# Altium schematic sheet Napajanje_1.SchDoc
size A4
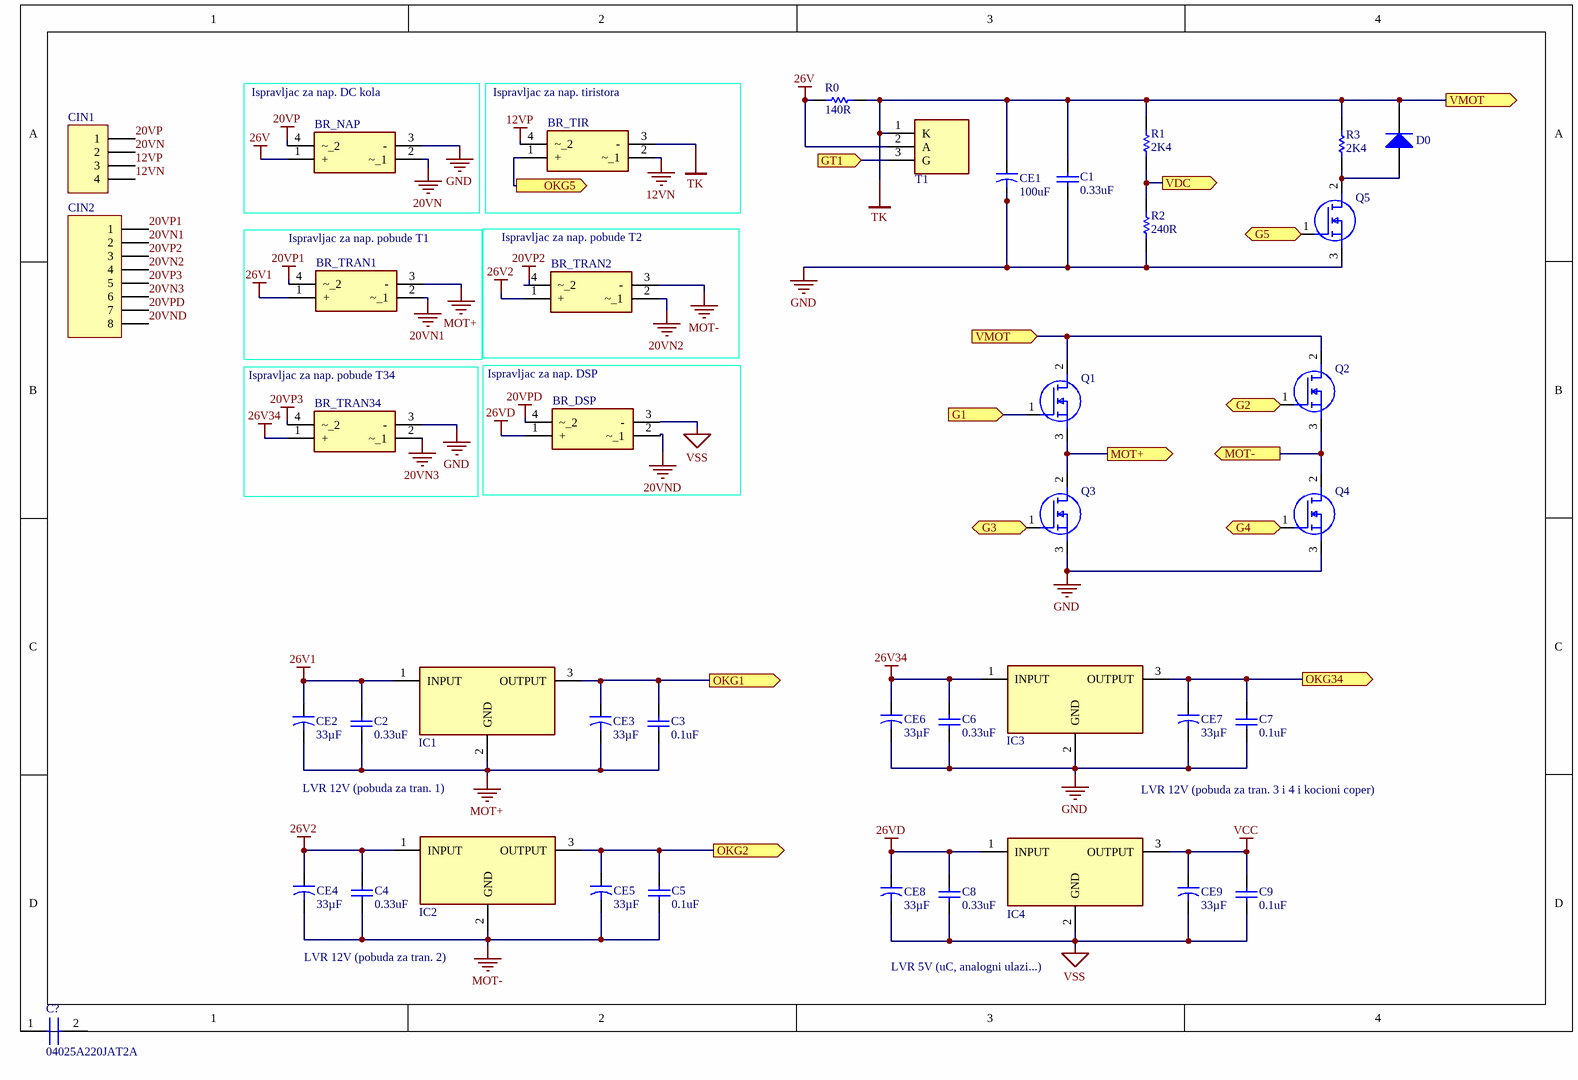
[diagram p0: Napajanje_1.SchDoc]

## Parts
BR_DSP  W04G-E4/51GI-ND  [BRIGE RECTIFIER]  (value not drawn)
BR_NAP  W04G-E4/51GI-ND  [BRIGE RECTIFIER]  (value not drawn)
BR_TIR  W04G-E4/51GI-ND  [BRIGE RECTIFIER]  (value not drawn)
BR_TRAN1  W04G-E4/51GI-ND  [BRIGE RECTIFIER]  (value not drawn)
BR_TRAN2  W04G-E4/51GI-ND  [BRIGE RECTIFIER]  (value not drawn)
BR_TRAN34  W04G-E4/51GI-ND  [BRIGE RECTIFIER]  (value not drawn)
C1  value 0.33uF  [CAP3, 0.33uF, 50V]  (hidden comment: 1C20Z5U334M050B-ND)  (graphical)
C2  value 0.33uF  [CAP3, 0.33uF, 50V]  (hidden comment: 1C20Z5U334M050B-ND)  (graphical)
C3  value 0.1uF  [CAP4, 0.1uF, 50V]  (hidden comment: BC1160TR-ND)
C4  value 0.33uF  [CAP3, 0.33uF, 50V]  (hidden comment: 1C20Z5U334M050B-ND)  (graphical)
C5  value 0.1uF  [CAP4, 0.1uF, 50V]  (hidden comment: BC1160TR-ND)
C6  value 0.33uF  [CAP3, 0.33uF, 50V]  (hidden comment: 1C20Z5U334M050B-ND)  (graphical)
C7  value 0.1uF  [CAP4, 0.1uF, 50V]  (hidden comment: BC1160TR-ND)
C8  value 0.33uF  [CAP3, 0.33uF, 50V]  (hidden comment: 1C20Z5U334M050B-ND)  (graphical)
C9  value 0.1uF  [CAP4, 0.1uF, 50V]  (hidden comment: BC1160TR-ND)
C?  04025A220JAT2A  [CAPC1005X56N]
CE1  value 100uF  [CAP2 100uF, 35V]  (hidden comment: 399-6104-ND)
CE2  value 33µF  [CAP1 33uF, 35V]  (hidden comment: 399-6575-ND)
CE3  value 33µF  [CAP1 33uF, 35V]  (hidden comment: 399-6575-ND)
CE4  value 33µF  [CAP1 33uF, 35V]  (hidden comment: 399-6575-ND)
CE5  value 33µF  [CAP1 33uF, 35V]  (hidden comment: 399-6575-ND)
CE6  value 33µF  [CAP1 33uF, 35V]  (hidden comment: 399-6575-ND)
CE7  value 33µF  [CAP1 33uF, 35V]  (hidden comment: 399-6575-ND)
CE8  value 33µF  [CAP1 33uF, 35V]  (hidden comment: 399-6575-ND)
CE9  value 33µF  [CAP1 33uF, 35V]  (hidden comment: 399-6575-ND)
CIN1  Header  [HEADER 4 PIN]  (value not drawn)
CIN2  (no value)  [HEADER 8 PIN]
D0  UF4007TR-ND  [DIODE, 1000V, 1A]  (value not drawn)
IC1  512-LM7812ACT  [LM7812ACT, 1A]  (value not drawn)
IC2  512-LM7812ACT  [LM7812ACT, 1A]  (value not drawn)
IC3  512-LM7812ACT  [LM7812ACT, 1A]  (value not drawn)
IC4  LM7805ACT  [LM7805ACT, 1A]  (value not drawn)
Q1  STP7NK40ZFP  [MOSFET 400V, 5.4A]  (value not drawn)
Q2  STP7NK40ZFP  [MOSFET 400V, 5.4A]  (value not drawn)
Q3  STP7NK40ZFP  [MOSFET 400V, 5.4A]  (value not drawn)
Q4  STP7NK40ZFP  [MOSFET 400V, 5.4A]  (value not drawn)
Q5  STP7NK40ZFP  [MOSFET 400V, 5.4A]  (value not drawn)
R0  value 140R  [RES5, 140R, 0.25W - duplicate]  (hidden comment: 140XBK-ND)
R1  value 2K4  [RES2, 2K4, 0.25W - duplicate]  (hidden comment: 270QBK-ND)
R2  value 240R  [RES1, 240R, 0.25W]  (hidden comment: 270QBK-ND)
R3  value 2K4  [RES2, 2K4, 0.25W - duplicate]  (hidden comment: 270QBK-ND)
T1  Thyristor1  [THYRISTOR 400V, 8A]  (value not drawn)

## Sub-sheets
Ispravljac za nap. DC kola = ?: no entries
Ispravljac za nap. DSP = ?: no entries
Ispravljac za nap. pobude T1 = ?: no entries
Ispravljac za nap. pobude T2 = ?: no entries
Ispravljac za nap. pobude T34 = ?: no entries
Ispravljac za nap. tiristora = ?: no entries

## Ports
G1 (in), G2 (in), G3 (in), G4 (in), G5 (in), GT1 (in), MOT+ (out), MOT- (out), OKG1 (out), OKG2 (out), OKG5 (out), OKG34 (out), VDC (out), VMOT (in), VMOT (out)

## Nets
12VN: BR_TIR.2(~_1) CIN1.4
12VP: BR_TIR.4(~_2) CIN1.3
20VN: BR_NAP.2(~_1) CIN1.2
20VN1: BR_TRAN1.2(~_1) CIN2.2
20VN2: BR_TRAN2.2(~_1) CIN2.4
20VN3: BR_TRAN34.2(~_1) CIN2.6
20VND: BR_DSP.2(~_1) CIN2.8
20VP: BR_NAP.4(~_2) CIN1.1
20VP1: BR_TRAN1.4(~_2) CIN2.1
20VP2: BR_TRAN2.4(~_2) CIN2.3
20VP3: BR_TRAN34.4(~_2) CIN2.5
20VPD: BR_DSP.4(~_2) CIN2.7
26V: BR_NAP.1(+) R0.2 T1.2(A)
26V1: BR_TRAN1.1(+) C2.2 CE2.1 IC1.1(INPUT)
26V2: BR_TRAN2.1(+) C4.2 CE4.1 IC2.1(INPUT)
26V34: BR_TRAN34.1(+) C6.2 CE6.1 IC3.1(INPUT)
26VD: BR_DSP.1(+) C8.2 CE8.1 IC4.1(INPUT)
GND: BR_NAP.3(-) BR_TRAN34.3(-) C1.1 C6.1 C7.1 CE1.2 CE6.2 CE7.2 IC3.2(GND) Q3.3(S) Q4.3(S) Q5.3(S) R2.1
MOT+: BR_TRAN1.3(-) C2.1 C3.1 CE2.2 CE3.2 IC1.2(GND)
MOT-: BR_TRAN2.3(-) C4.1 C5.1 CE4.2 CE5.2 IC2.2(GND)
TK: BR_TIR.3(-) C1.2 CE1.1 D0.2(K) Q1.2(D) Q2.2(D) R0.1 R1.2 R3.2 T1.1(K) ; port VMOT
VCC: C9.2 CE9.1 IC4.3(OUTPUT)
VSS: BR_DSP.3(-) C8.1 C9.1 CE8.2 CE9.2 IC4.2(GND)
G1: Q1.1(G) ; port G1
G2: Q2.1(G) ; port G2
G3: Q3.1(G) ; port G3
G4: Q4.1(G) ; port G4
G5: Q5.1(G) ; port G5
GT1: T1.3(G) ; port GT1
MOT+: Q1.3(S) Q3.2(D) ; port MOT+  [a separate net that carries the same name]
MOT-: Q2.3(S) Q4.2(D) ; port MOT-  [a separate net that carries the same name]
OKG1: C3.2 CE3.1 IC1.3(OUTPUT) ; port OKG1
OKG2: C5.2 CE5.1 IC2.3(OUTPUT) ; port OKG2
OKG5: BR_TIR.1(+) ; port OKG5
OKG34: C7.2 CE7.1 IC3.3(OUTPUT) ; port OKG34
VDC: R1.1 R2.2 ; port VDC
NetD0_1: D0.1(A) Q5.2(D) R3.1

Not connected (* = marked no-connect by the designer): C? 1 2

## Notes on the sheet
- LVR 12V (pobuda za tran. 1)
- LVR 12V (pobuda za tran. 3 i 4 i kocioni coper)
- LVR 12V (pobuda za tran. 2)
- LVR 5V (uC, analogni ulazi...)

## Library data of the parts
BR_DSP BR_NAP BR_TIR BR_TRAN1 BR_TRAN2 BR_TRAN34 = Bridge rectifier: 1 Phase, 400V, 1.5A; Detailed Description: Bridge Rectifier Single Phase Standard 400V Through Hole WOG; Datasheet link: http://www.vishay.com/docs/88769/woo5g.pdf; Digi-Key Part Number: W04G-E4/51GI-ND; Manufacturer Part Number: W04G-E4/51
C1 C2 C4 C6 C8 = Cap3: CER 0.33uF, 50V; Manufacturer: Vishay BC Components; Digi-Key Part Number: 1C20Z5U334M050B-ND; Datasheet Link: https://media.digikey.com/pdf/Data%20Sheets/BC%20Components%20PDFs/1C-9C_Series_Rev_Sep_2015.pdf; Manufacturer Part Number: 1C20Z5U334M050B
C3 C5 C7 C9 = Cap4: CER 0.1uF, 50V; Manufacturer: Vishay BC Components; Manufacturer Part Number: K104Z15Y5VF5TL2; Detailed Description: 0.1µF -20%, +80% 50V Ceramic Capacitor Y5V (F) Radial; Digi-Key Part Number: BC1160TR-ND; Datasheet: http://www.vishay.com/docs/45171/kseries.pdf
C? = 04025A220JAT2A: Capacitor; Manufacturer_Name: AVX; Datasheet Link: http://www.mouser.com/catalog/supplier/library/pdf/AVXSurfaceMountCeramic.pdf; Height: 0.56mm; Manufacturer_Part_Number: 04025A220JAT2A; Arrow Part Number: 04025A220JAT2A; Arrow Price/Stock: https://www.arrow.com/en/products/04025a220jat2a/avx; Mouser Part Number: 581-04025A220J; Mouser Price/Stock: https://www.mouser.com/Search/Refine.aspx?Keyword=581-04025A220J
CE1 = Cap2: ALU 100uF, 35V; Manufacturer: KEMET; Manufacturer Part Number: ESK107M035AE3AA; Digi-Key Part Number: 399-6104-ND; Datasheet link: https://api.kemet.com/component-edge/download/specsheet/ESK107M035AE3AA.pdf
CE2-CE9 = Cap1: ALU 33uF, 35V; Manufacturer: KEMET; Manufacturer Part Number: ESH336M035AC3AA; Detailed Description: 33µF 35V Aluminum Electrolytic Capacitors Radial, Can  2000 Hrs @ 105°C; Digi-Key Part Number: 399-6575-ND; Datasheet: https://content.kemet.com/datasheets/KEM_A4005_ESH.pdf
CIN1 = Header 4: Header, 4-Pin; Manufacturer: TE Connectivity AMP Connectors; Manufacturer Part Number: 3-282836-2; Detailed Description: 4 Position Wire to Board Terminal Block Horizontal with Board 0.197" (5.00mm) Through Hole; Digi-Key Part Number: A136029-ND; Datasheet link: https://www.te.com/commerce/DocumentDelivery/DDEController?Action=srchrtrv&DocNm=282836&DocType=Customer+Drawing&DocLang=English
CIN2 = Connector 8: Header, 8-Pin; Manufacturer: Phoenix Contact; Manufacturer Part Number: 1727078; Detailed Description: 8 Position Wire to Board Terminal Block Horizontal with Board 0.150" (3.81mm) Through Hole; Digi-Key Part Number: 277-1953-ND; Datasheet link: https://media.digikey.com/pdf/Data%20Sheets/Phoenix%20Contact%20PDFs/1727078.pdf
D0 = Diode: DIODE GEN PURP 1KV 1A DO41; Manufacturer: ON Semiconductor; Manufacturer Part Number: UF4007; Detailed Description: Diode Standard 1000V 1A Through Hole DO-204AL (DO-41); Digi-Key Part Number: UF4007TR-ND; Datasheet link: https://www.onsemi.com/pub/Collateral/UF4007-D.pdf
IC1-IC3 = IC2: LM7812ACT, 1A; Manufacturer_Name: ON Semiconductor; Datasheet Link: https://componentsearchengine.com/Datasheets/2/LM7805ACT.pdf; Manufacturer_Part_Number: LM7812ACT; Mouser Part Number: 512-LM7812ACT; Mouser Price/Stock: https://www.mouser.com/Search/Refine.aspx?Keyword=512-LM7805ACT; RS Part Number: 8062839; RS Price/Stock: http://uk.rs-online.com/web/p/products/8062839
IC4 = IC1: LM7805ACT, 1A; Manufacturer_Name: ON Semiconductor; Datasheet Link: https://componentsearchengine.com/Datasheets/2/LM7805ACT.pdf; Height: 4.7mm; Manufacturer_Part_Number: LM7805ACT; Mouser Part Number: 512-LM7805ACT; Mouser Price/Stock: https://www.mouser.com/Search/Refine.aspx?Keyword=512-LM7805ACT; RS Part Number: 8062839; RS Price/Stock: http://uk.rs-online.com/web/p/products/8062839
Q1-Q5 = MOSFET: MOSFET (N-Channel); Manufacturer_Name: STMicroelectronics; Allied_Number: 70547873; Datasheet Link: http://www.st.com/web/en/resource/technical/document/datasheet/CD00003040.pdf; Height: 4.6mm; Manufacturer_Part_Number: STP7NK40ZFP; Mouser Part Number: 511-STP7NK40ZFP; Mouser Price/Stock: https://www.mouser.com/Search/Refine.aspx?Keyword=511-STP7NK40ZFP; RS Part Number: 8107418; RS Price/Stock: https://uk.rs-online.com/web/p/products/8107418; Allied Price/Stock: http://www.alliedelec.com/stmicroelectronics-stp7nk40zfp/70547873/
R0 = Res5: 140 Ohm, 0.25W; Manufacturer: Yageo; Manufacturer Part Number: MFR-25FBF52-140R; Detailed Description: 1 kOhms ±5% 0.25W, 1/4W Through Hole Resistor Axial  Carbon Film; Digi-Key Part Number: 140XBK-ND; Datasheet link: https://www.yageo.com/upload/media/product/products/datasheet/lr/Yageo_LR_CFR_1.pdf
R1 R3 = Res2: 2K4, 0.25W
R2 = Res1: 240 Ohm, 0.25W; Manufacturer: Yageo; Manufacturer Part Number: CFR-25JB-52-270R; Detailed Description: 240 Ohms ±5% 0.25W, 1/4W Through Hole Resistor Axial  Carbon Film; Digi-Key Part Number: 270QBK-ND; Datasheet link: https://www.yageo.com/upload/media/product/products/datasheet/lr/Yageo_LR_CFR_1.pdf
T1 = Thyristor1: SCR, 400V, 8A; Manufacturer: STMicroelectronics; Manufacturer Part Number: TXN408GRG; Detailed Description: SCR 400V 8A Standard Recovery Through Hole TO-220AB; Digi-Key Part Number: 497-4480-5-ND; Datasheets: https://media.digikey.com/pdf/Data%20Sheets/ST%20Microelectronics%20PDFS/TXN,TYN%20058-1008%20G.pdf